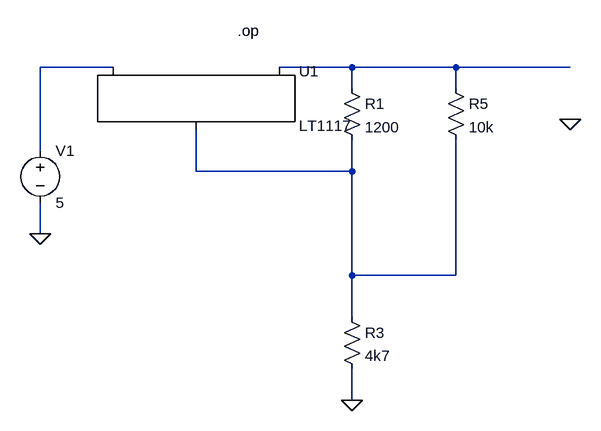
[diagram p0: schematic BaroSense.asc]
BaroSense.asc, the LTspice schematic file:
Version 4
SHEET 1 880 680
WIRE -96 16 -208 16
WIRE 272 16 160 16
WIRE 432 16 272 16
WIRE 608 16 432 16
WIRE 272 48 272 16
WIRE 432 48 432 16
WIRE -208 144 -208 16
WIRE 32 176 32 112
WIRE 272 176 272 128
WIRE 272 176 32 176
WIRE -208 272 -208 224
WIRE 272 336 272 176
WIRE 432 336 432 128
WIRE 432 336 272 336
WIRE 272 400 272 336
WIRE 272 528 272 480
FLAG -208 272 0
FLAG 272 528 0
FLAG 608 96 0
DATAFLAG 432 16 ""
DATAFLAG 272 336 ""
DATAFLAG 144 176 ""
SYMBOL PowerProducts\\LT1117 32 16 R0
SYMATTR InstName U1
SYMBOL voltage -208 128 R0
WINDOW 123 0 0 Left 0
WINDOW 39 0 0 Left 0
SYMATTR InstName V1
SYMATTR Value 5
SYMBOL res 256 32 R0
SYMATTR InstName R1
SYMATTR Value 1200
SYMBOL res 256 384 R0
SYMATTR InstName R3
SYMATTR Value 4k7
SYMBOL res 416 32 R0
SYMATTR InstName R5
SYMATTR Value 10k
TEXT 96 -40 Left 2 !.op

The netlist it stands for:
* BaroSense.asc
XU1 N003 N002 N001 LT1117
V1 N001 0 5
R1 N002 N003 1200
R3 N003 0 4k7
R5 N002 N003 10k
.op
.lib LT1117.lib
.backanno
.end